# EAGLE design mml_mcu (EAGLE 9.6.2)

## Sheet 1 of 2
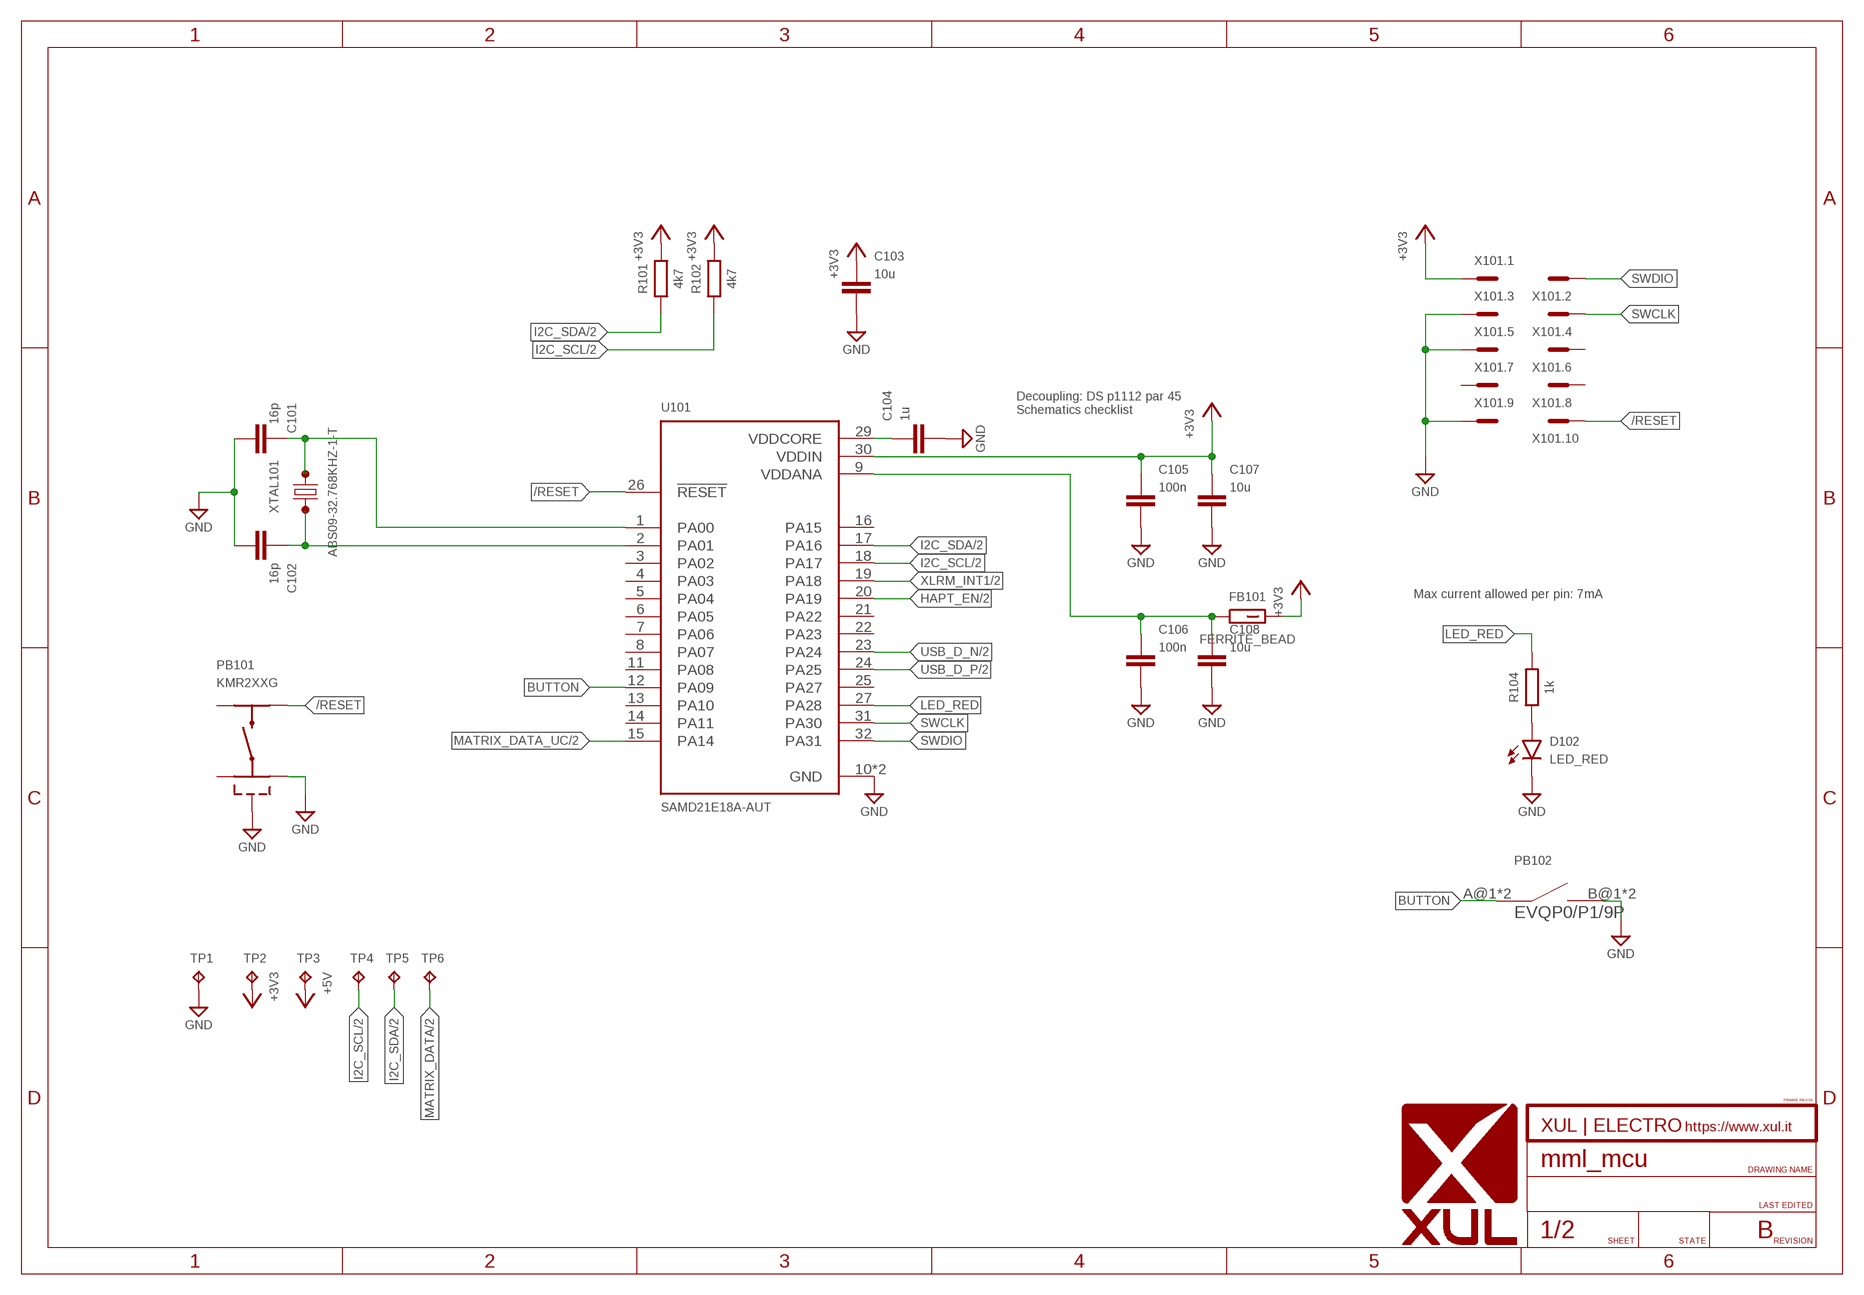
[diagram p0: schematic, sheet 1]
FRAME101 (FRAME-XUL-A4L-LOC): REV: B

### Parts
C101  16p  C_CHIP-0603(1608-METRIC)  [CAPC1608X85]
C102  16p  C_CHIP-0603(1608-METRIC)  [CAPC1608X85]
C103  10u  C_CHIP-0805(2012-METRIC)  [CAPC2012X110]
C104  1u  C_CHIP-0603(1608-METRIC)  [CAPC1608X85]
C105  100n  C_CHIP-0603(1608-METRIC)  [CAPC1608X85]
C106  100n  C_CHIP-0603(1608-METRIC)  [CAPC1608X85]
C107  10u  C_CHIP-0805(2012-METRIC)  [CAPC2012X110]
C108  10u  C_CHIP-0805(2012-METRIC)  [CAPC2012X110]
D102  LED_RED  CHIP-FLAT-R_0805  [LEDC2012X110N_FLAT-R]
FB101  FERRITE_BEAD  FBCHIP-0603(1608-METRIC)  [BEADC1608X95N]
PB101  KMR2XXG  [KMR2XXG]
PB102  EVQP0/P1/9P  [EVQP0/P1/9P]
R101  4k7  R_CHIP-0603(1608-METRIC)  [RESC1608X60]
R102  4k7  R_CHIP-0603(1608-METRIC)  [RESC1608X60]
R104  1k  R_CHIP-0603(1608-METRIC)  [RESC1608X60]
TP1  TPTP15R  [TP15R]
TP2  TPTP15R  [TP15R]
TP3  TPTP15R  [TP15R]
TP4  TPTP15R  [TP15R]
TP5  TPTP15R  [TP15R]
TP6  TPTP15R  [TP15R]
U101  SAMD21E18A-AUT  SAMD21E  [QFP80P900X900X120-32N]
X101  M50-3600542R  [M50-3600542R]
XTAL101  ABS09-32.768KHZ-1-T  CM415  [XTAL410X150X90]

### Nets
+3V3: C103.1 C105.1 C107.1 FB101.2 R101.2 R102.2 TP2.TP U101.30(VDDIN) X101.1 ; also sheet 2
+5V: TP3.TP ; also sheet 2
/RESET: PB101.1 U101.26(!RESET) X101.10
BUTTON: PB102.A@1(A) PB102.A@2(A) U101.12(PA09)
GND: C101.2 C102.2 C103.2 C104.2 C105.2 C106.2 C107.2 C108.2 D102.C PB101.2 PB101.5 PB102.B@1(B) PB102.B@2(B) TP1.TP U101.10(GND) U101.28(GND) X101.3 X101.5 X101.9 ; also sheet 2
HAPT_EN: U101.20(PA19) ; also sheet 2
I2C_SCL: R102.1 TP4.TP U101.18(PA17) ; also sheet 2
I2C_SDA: R101.1 TP5.TP U101.17(PA16) ; also sheet 2
LED_RED: R104.2 U101.27(PA28)
MATRIX_DATA: TP6.TP ; also sheet 2
MATRIX_DATA_UC: U101.15(PA14) ; also sheet 2
N$13: C101.1 U101.1(PA00) XTAL101.1(A)
N$14: C102.1 U101.2(PA01) XTAL101.2(B)
N$15: C104.1 U101.29(VDDCORE)
N$17: D102.A R104.1
N$23: C106.1 C108.1 FB101.1 U101.9(VDDANA)
SWCLK: U101.31(PA30) X101.4
SWDIO: U101.32(PA31) X101.2
USB_D_N: U101.23(PA24) ; also sheet 2
USB_D_P: U101.24(PA25) ; also sheet 2
XLRM_INT1: U101.19(PA18) ; also sheet 2
Unconnected: PB101.3 PB101.4 U101.3(PA02) U101.4(PA03) U101.5(PA04) U101.6(PA05) U101.7(PA06) U101.8(PA07) U101.11(PA08) U101.13(PA10) U101.14(PA11) U101.16(PA15) U101.21(PA22) U101.22(PA23) U101.25(PA27) X101.6 X101.7 X101.8

### Notes on the sheet
- Decoupling: DS p1112 par 45
  Schematics checklist
- Max current allowed per pin: 7mA

## Sheet 2 of 2
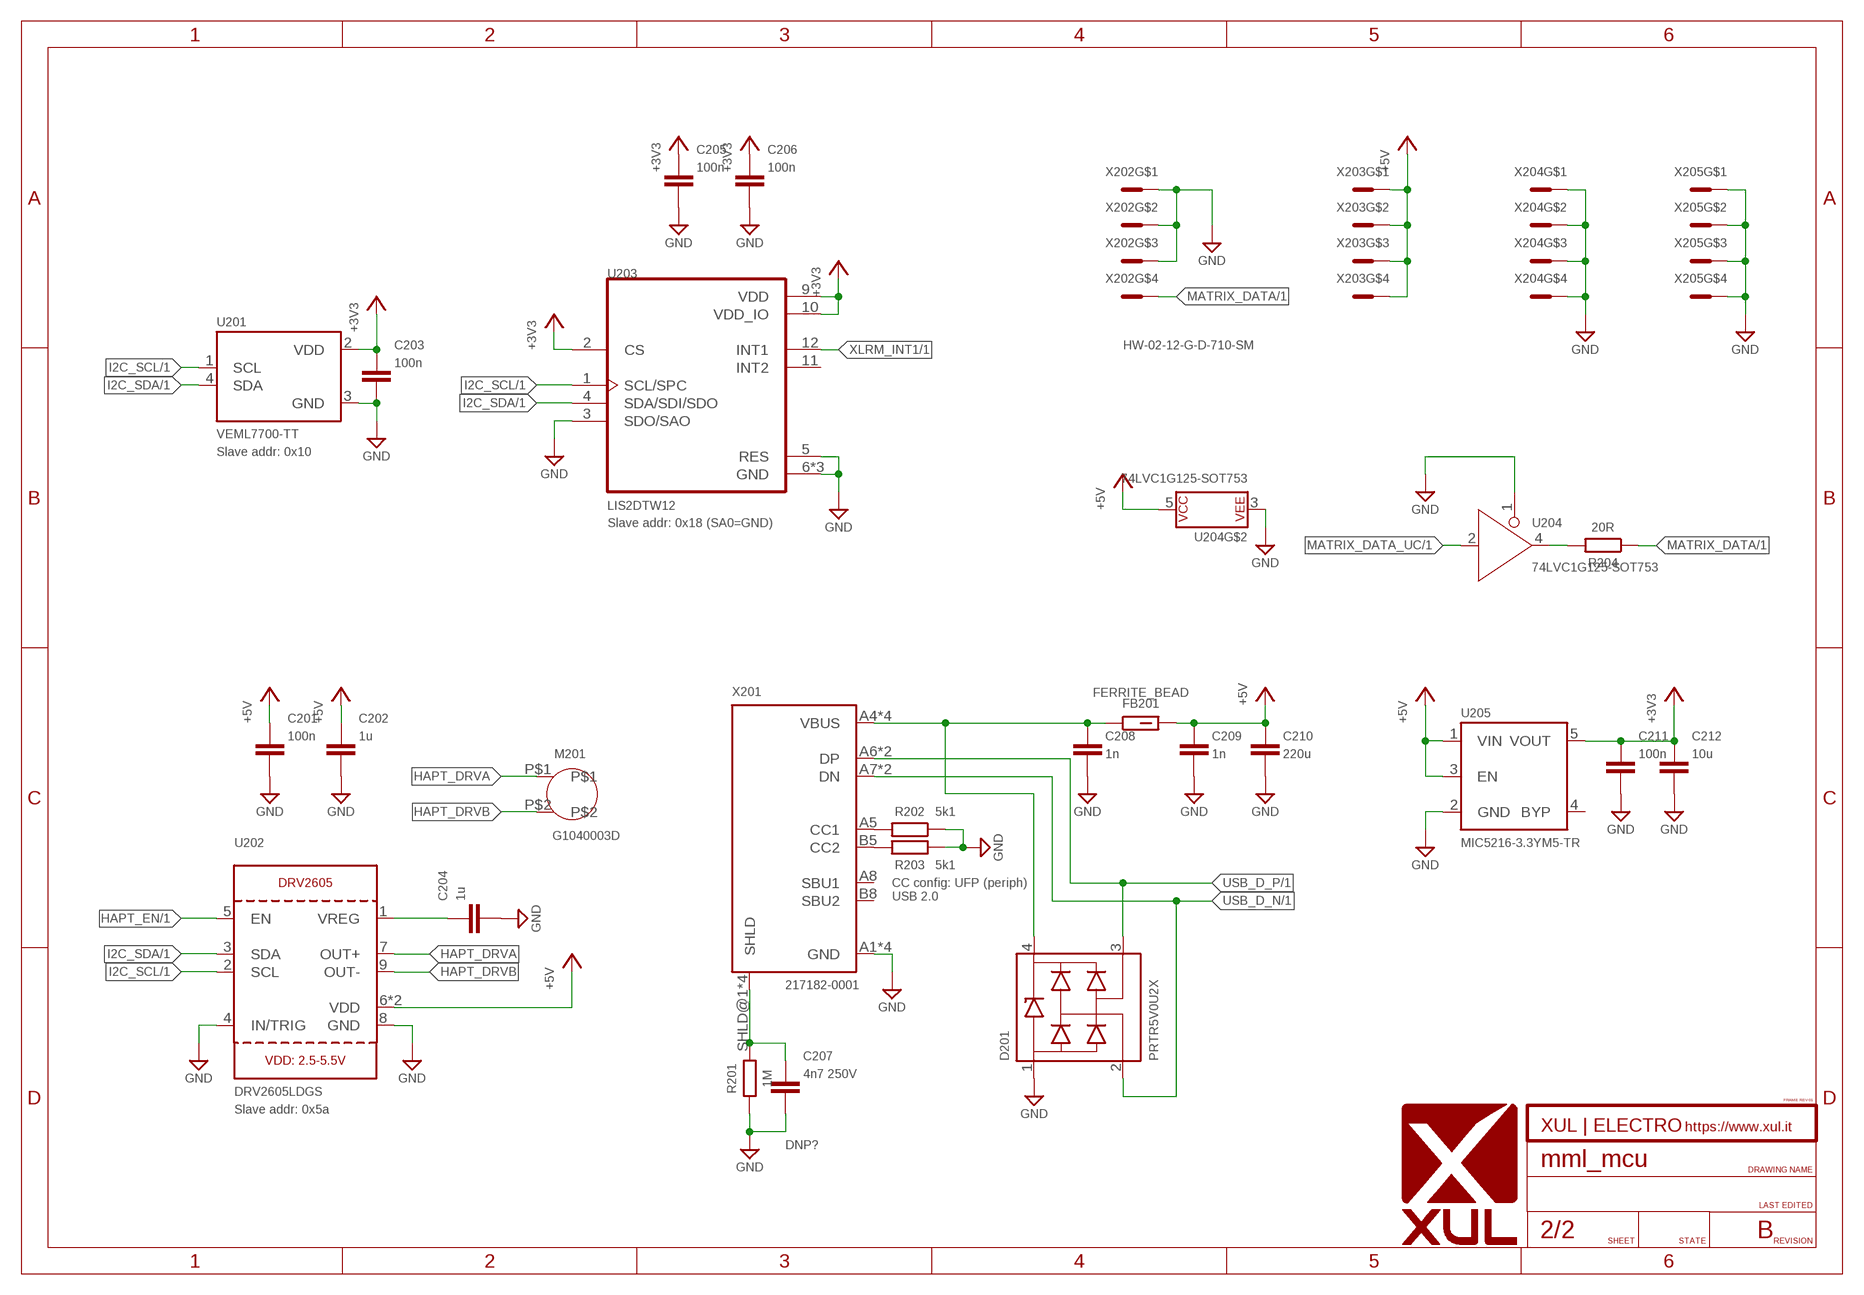
[diagram p1: schematic, sheet 2]
FRAME201 (FRAME-XUL-A4L-LOC): REV: B

### Parts
C201  100n  C_CHIP-0603(1608-METRIC)  [CAPC1608X85]
C202  1u  C_CHIP-0603(1608-METRIC)  [CAPC1608X85]
C203  100n  C_CHIP-0603(1608-METRIC)  [CAPC1608X85]
C204  1u  C_CHIP-0603(1608-METRIC)  [CAPC1608X85]
C205  100n  C_CHIP-0603(1608-METRIC)  [CAPC1608X85]
C206  100n  C_CHIP-0603(1608-METRIC)  [CAPC1608X85]
C207  4n7 250V  C_CHIP-0603(1608-METRIC)  [CAPC1608X85]
C208  1n  C_CHIP-0603(1608-METRIC)  [CAPC1608X85]
C209  1n  C_CHIP-0603(1608-METRIC)  [CAPC1608X85]
C210  220u  C_CHIP-1206(3216-METRIC)  [CAPC3216X135]
C211  100n  C_CHIP-0603(1608-METRIC)  [CAPC1608X85]
C212  10u  C_CHIP-0805(2012-METRIC)  [CAPC2012X110]
D201  PRTR5V0U2X  [SOT190P230X110-4N]
FB201  FERRITE_BEAD  FBCHIP-0603(1608-METRIC)  [BEADC1608X95N]
M201  G1040003D  [G1040003D]
R201  1M  R_CHIP-0603(1608-METRIC)  [RESC1608X60]
R202  5k1  R_CHIP-0603(1608-METRIC)  [RESC1608X60]
R203  5k1  R_CHIP-0603(1608-METRIC)  [RESC1608X60]
R204  20R  R_CHIP-0603(1608-METRIC)  [RESC1608X60]
U201  VEML7700-TT  [XDCR_VEML7700-TT]
U202  DRV2605LDGS  DRV2605_SOP  [PSOP10]
U203  LIS2DTW12  LIS2DH12TR  [PQFN50P200X200100-12N]
U204  74LVC1G125-SOT753  [SOT95P280X145-5N]
U205  MIC5216-3.3YM5-TR  SPX3819SOT-23-5  [SOT95P280X145-5N]
X201  217182-0001  [217182-0001]
X202  HW-02-10-T-D-500-SM  [HW-02-10-T-D-500-SM]
X203  HW-02-10-T-D-500-SM  [HW-02-10-T-D-500-SM]
X204  HW-02-10-T-D-500-SM  [HW-02-10-T-D-500-SM]
X205  HW-02-10-T-D-500-SM  [HW-02-10-T-D-500-SM]

### Nets
+3V3: C203.1 C205.1 C206.1 C211.1 C212.1 U201.2(VDD) U203.2(CS) U203.9(VDD) U203.10(VDD_IO) U205.5(VOUT) ; also sheet 1
+5V: C201.1 C202.1 C209.1 C210.1 FB201.2 U202.6(VDD) U202.10(VDD) U204.5(P$V+) U205.1(VIN) U205.3(EN) X203.P$1 X203.P$2 X203.P$3 X203.P$4 ; also sheet 1
GND: C201.2 C202.2 C203.2 C204.2 C205.2 C206.2 C207.2 C208.2 C209.2 C210.2 C211.2 C212.2 D201.1 R201.1 R202.1 R203.1 U201.3(GND) U202.4(IN/TRIG) U202.8(GND) U203.3(SDO/SAO) U203.5(RES) U203.6(GND) U203.7(GND) U203.8(GND) U204.1(/OE) U204.3(P$V-) U205.2(GND) X201.A1(GND) X201.A12(GND) X201.B1(GND) X201.B12(GND) X202.P$1 X202.P$2 X202.P$3 X204.P$1 X204.P$2 X204.P$3 X204.P$4 X205.P$1 X205.P$2 X205.P$3 X205.P$4 ; also sheet 1
HAPT_DRVA: M201.P$1 U202.7(OUT+)
HAPT_DRVB: M201.P$2 U202.9(OUT-)
HAPT_EN: U202.5(EN) ; also sheet 1
I2C_SCL: U201.1(SCL) U202.2(SCL) U203.1(SCL/SPC) ; also sheet 1
I2C_SDA: U201.4(SDA) U202.3(SDA) U203.4(SDA/SDI/SDO) ; also sheet 1
MATRIX_DATA: R204.1 X202.P$4 ; also sheet 1
MATRIX_DATA_UC: U204.2(A) ; also sheet 1
N$1: C204.1 U202.1(VREG)
N$2: C207.1 R201.2 X201.SHLD@1(SHLD) X201.SHLD@2(SHLD) X201.SHLD@3(SHLD) X201.SHLD@4(SHLD)
N$10: C208.1 D201.4 FB201.1 X201.A4(VBUS) X201.A9(VBUS) X201.B4(VBUS) X201.B9(VBUS)
N$16: R204.2 U204.4(Y)
N$20: R202.2 X201.A5(CC1)
N$21: R203.2 X201.B5(CC2)
USB_D_N: D201.2 X201.A7(DN) X201.B7(DN) ; also sheet 1
USB_D_P: D201.3 X201.A6(DP) X201.B6(DP) ; also sheet 1
XLRM_INT1: U203.12(INT1) ; also sheet 1
Unconnected: U203.11(INT2) U205.4(BYP) X201.A8(SBU1) X201.B8(SBU2)

### Notes on the sheet
- HW-02-12-G-D-710-SM
- Slave addr: 0x10
- Slave addr: 0x18 (SA0=GND)
- CC config: UFP (periph)
  USB 2.0
- Slave addr: 0x5a
- DNP?

## Library data of the parts
C101-C108 C201-C212 = Capacitor:C: Capacitor - Generic; CATEGORY: Capacitor
D102 = LED:CHIP-FLAT-R; CATEGORY: LED; COLOR: RED; DESCRIPTION: CHIP LED FLAT; SUB-CATEGORY: CHIP; TYPE: FLAT_TOP
D201 = xul:PRTR5V0U2X: PRTR5V0U2X Ultra low capacitance double rail-to-rail ESD protection diode
FB101 FB201 = Filter:FB: Ferrite Bead - Generic; CATEGORY: Filter; SUB-CATEGORY: Ferrite bead
M201 = xul:G1040003D: Jinlong Machinery & Electronics G1040003D LRA Coin Vibration Motor
PB101 = xul:KMR2XXG: KMR2 series Tactile SPST-NO switch
PB102 = xul:EVQP0/P1/9P
R101 R102 R104 R201-R204 = Resistor:R: Resistor Fixed - Generic; CATEGORY: Resistor; SUB-CATEGORY: Fixed
TP1-TP6 = testpad:TP: Test pad
U101 = xul:SAMD21E: ARM Cortex-M0+ SAM D21E Microcontroller IC 32-Bit 48MHz 256KB (256K x 8) FLASH 32-TQFP (7x7) Check prices <https://pricing.snapeda.com/parts/ATSAMD21E18A-AUT/Microchip/view-part?ref=eda>
U201 = xul:VEML7700-TT: Ambient Light Sensors Opr 2.5-3.6V 0.005lx Top View 16bit I2C Check prices <https://pricing.snapeda.com/parts/VEML7700-TT/Vishay%20Semiconductor/view-part?ref=eda>; AVAILABILITY: In Stock; DESCRIPTION: Optical Sensor 4-SMD, J-Lead; MF: Vishay Semiconductor; MP: VEML7700-TT; PACKAGE: SMD-4 Vishay Semiconductor; PRICE: None; PURCHASE-URL: https://pricing.snapeda.com/search/part/VEML7700-TT/?ref=eda
U202 = microbuilder:DRV2605: DRV2605 - Haptic Driver for ERM/LRA Motors; LCSC_PART: C527464
U203 = LIS2DH12TR:LIS2DH12TR: MEMS digital output motion sensor: ultra low-power high performance 3-axes femto accelerometer Check prices <https://pricing.snapeda.com/parts/LIS2DH12TR/STMicroelectronics/view-part?ref=eda>; AVAILABILITY: In Stock; DESCRIPTION: Accelerometer X, Y, Z Axis ±2g, 4g, 8g, 16g 0.5Hz ~ 672Hz 12-LGA (2x2); LCSC_PART: C110926; MF: STMicroelectronics; MP: LIS2DH12TR; PACKAGE: LGA-12 STMicroelectronics; PRICE: None; PURCHASE-URL: https://pricing.snapeda.com/search/part/LIS2DH12TR/?ref=eda
U204 = xul:74LVC1G125
U205 = xul-vreg:SPX3819: SPX3819 500mA Low-Noise LDO Voltage Regulator
X101 = xul:M50-3600542R: Harwin M50-3600542R 2x5 SMT 50mils pinheader
X201 = xul:217182-0001: MOLEX 217182-0001 USB-Socket Vertical SMT L6.4 16C Type C Rec. USB2.0
X202-X205 = xul:HW-02-10-T-D-500-SM: HW-02-10-T-D-500-SM 2x2 SMD High Temperature Flexible Board Stacking Header, 0.100" Pitch
XTAL101 = xul:CM415: Citizen TUNING FORK 32768Hz CRYSTAL UNIT SMD

## Board
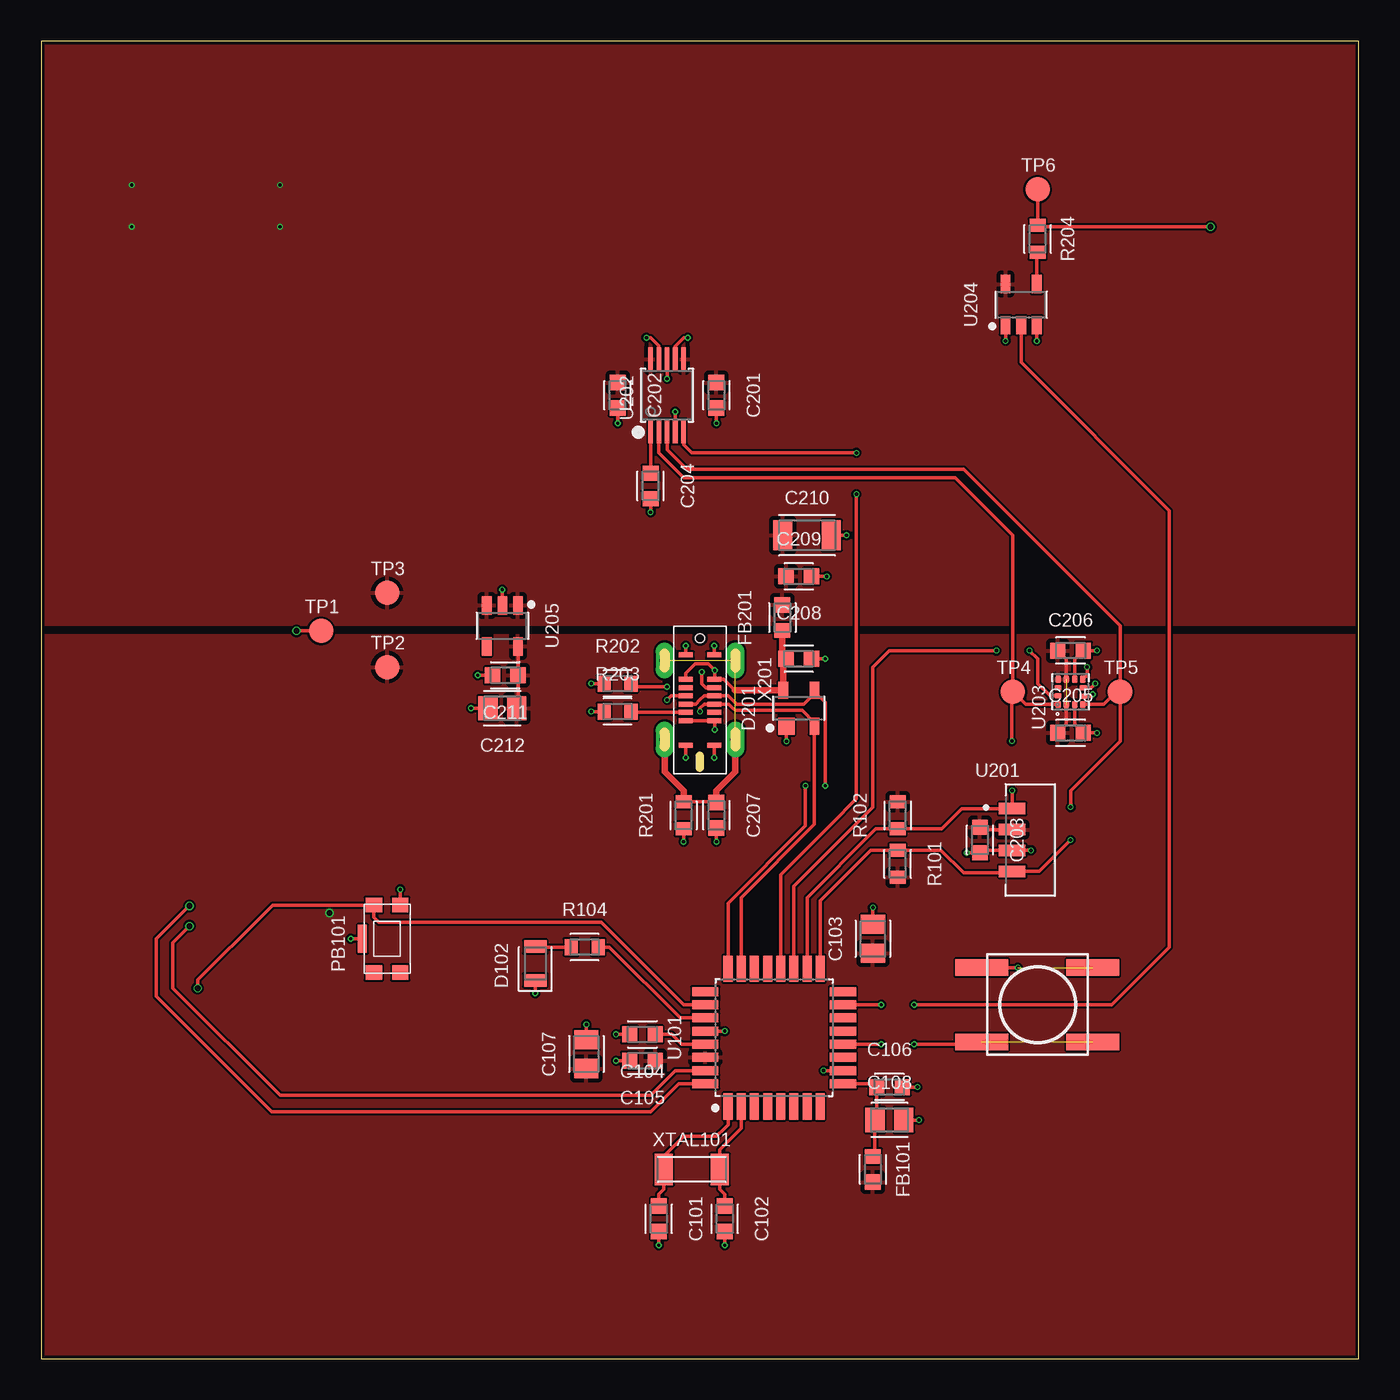
[diagram p2: board, top side]
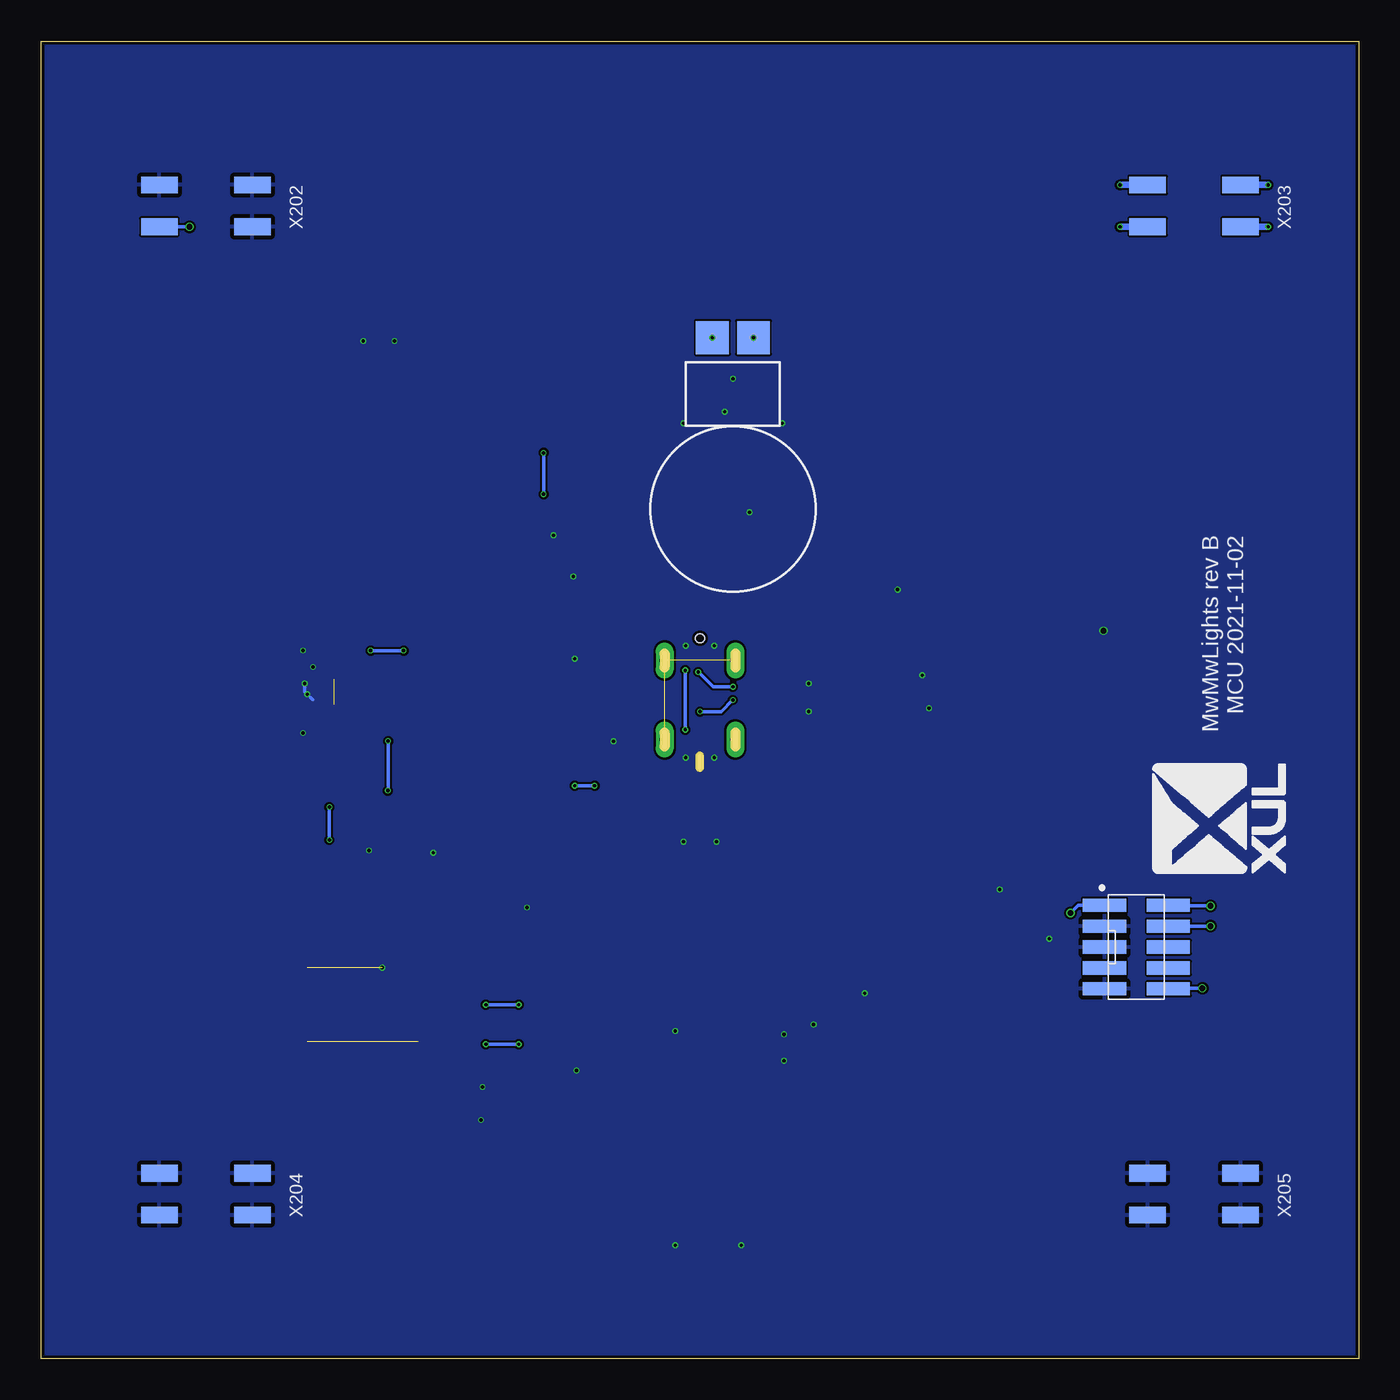
[diagram p3: board, bottom side, seen from below]

Size 80 x 80 mm. Coordinates in mm from the lower left corner, seen from the top.
Outline: 0,0 80,0 80,80 0,80 0,0
Copper layers (1*16): Top 0.035mm / dielectric 1.6mm / Bottom 0.035mm
Design rules "jlcpcb-2layers *": minimum track width 5mil, minimum drill 0.2mm, track to track 5mil, track to pad 5mil, pad to pad 5mil, via to via 5mil, smd to smd 5mil, copper to edge 0.2mm, drill to drill 6mil, minimum pad ring 10mil, minimum via ring 3mil, stop-mask expansion 4mil, vias tented up to drill 0mil, thermal gap 10mil

### Footprints (pad centres in the part's own frame; a part is rotated, then mirrored left to right if it is on the bottom)
CAPC1608X85 = smd 0.921 x 0.97: 1 -0.775,0; 2 0.775,0
CAPC2012X110 = smd 1.165 x 1.465: 1 -0.875,0; 2 0.875,0
CAPC3216X135 = smd 1.165 x 1.815: 1 -1.475,0; 2 1.475,0
LEDC2012X110N_FLAT-R = smd 0.762 x 1.362: A 1.025,0; C -1.025,0
SOT190P230X110-4N = smd 1.022 x 0.99: 1 -1.097,0.75 | smd 1.022 x 0.59: 2 -1.097,-0.95; 3 1.097,-0.95; 4 1.097,0.95
BEADC1608X95N = smd 0.9 x 0.97: 1 -0.785,0 | smd 0.933 x 0.97: 2 0.769,0
G1040003D = smd 2 x 2: P$1 3,1.25; P$2 3,-1.25
KMR2XXG = smd 0.9 x 1: 1 2.05,0.8; 2 2.05,-0.8; 3 -2.05,-0.8; 4 -2.05,0.8 | smd 1.7 x 0.55: 5 0,1.5
EVQP0/P1/9P = smd 1 x 3.2: A@1 -2.25,-3.34; A@2 -2.25,3.4; B@1 2.25,-3.34; B@2 2.25,3.4
RESC1608X60 = smd 0.799 x 0.974: 1 -0.815,0; 2 0.815,0
TP15R = smd 1.5 x 1.5: TP 0,0
QFP80P900X900X120-32N = smd 1.6 x 0.547: 1 -4.181,2.8; 2 -4.181,2; 3 -4.181,1.2; 4 -4.181,0.4; 5 -4.181,-0.4; 6 -4.181,-1.2; 7 -4.181,-2; 8 -4.181,-2.8; 17 4.181,-2.8; 18 4.181,-2; 19 4.181,-1.2; 20 4.181,-0.4; 21 4.181,0.4; 22 4.181,1.2; 23 4.181,2; 24 4.181,2.8 | smd 0.547 x 1.6: 9 -2.8,-4.181; 10 -2,-4.181; 11 -1.2,-4.181; 12 -0.4,-4.181; 13 0.4,-4.181; 14 1.2,-4.181; 15 2,-4.181; 16 2.8,-4.181; 25 2.8,4.181; 26 2,4.181; 27 1.2,4.181; 28 0.4,4.181; 29 -0.4,4.181; 30 -1.2,4.181; 31 -2,4.181; 32 -2.8,4.181
XDCR_VEML7700-TT = smd 1.6 x 0.7: 1 -1.55,1.905; 2 -1.55,0.635; 3 -1.55,-0.635; 4 -1.55,-1.905
PSOP10 = smd 0.28 x 1.45: 1 -1,-2.2; 2 -0.5,-2.2; 3 0,-2.2; 4 0.5,-2.2; 5 1,-2.2; 6 1,2.2; 7 0.5,2.2; 8 0,2.2; 9 -0.5,2.2; 10 -1,2.2
PQFN50P200X200100-12N = smd 0.45 x 0.35: 1 -0.765,0.75; 2 -0.765,0.25; 3 -0.765,-0.25; 4 -0.765,-0.75; 7 0.765,-0.75; 8 0.765,-0.25; 9 0.765,0.25; 10 0.765,0.75 | smd 0.35 x 0.45: 5 -0.265,-0.765; 6 0.25,-0.765; 11 0.25,0.765; 12 -0.25,0.765
SOT95P280X145-5N = smd 1.119 x 0.59: 1 -1.246,0.95; 2 -1.246,0; 3 -1.246,-0.95; 4 1.246,-0.95; 5 1.246,0.95
SOT95P280X145-5N' = smd 1.119 x 0.589: 1 -1.246,0.95; 2 -1.246,0; 3 -1.246,-0.95; 4 1.246,-0.95; 5 1.246,0.95
M50-3600542R = smd 0.8 x 2.62: 1 -2.54,-1.94; 2 -2.54,1.94; 3 -1.27,-1.94; 4 -1.27,1.94; 5 0,-1.94; 6 0,1.94; 7 1.27,-1.94; 8 1.27,1.94; 9 2.54,-1.94; 10 2.54,1.94
217182-0001 = smd 0.3 x 0.87: A1 -2.75,0.865; A4 -1.25,0.865; A5 -0.75,0.865; A6 -0.25,0.865; A7 0.25,0.865; A8 0.75,0.865; A9 1.25,0.865; A12 2.75,0.865; B1 2.75,-0.865; B4 1.25,-0.865; B5 0.75,-0.865; B6 0.25,-0.865; B7 -0.25,-0.865; B8 -0.75,-0.865; B9 -1.25,-0.865; B12 -2.75,-0.865 | drill 0.6 long: SHLD@1 -2.4,2.15; SHLD@2 2.4,2.15; SHLD@3 -2.4,-2.15; SHLD@4 2.4,-2.15 | hole 0.52: -3.75,0
HW-02-10-T-D-500-SM = smd 1.016 x 2.223: P$1 -1.27,2.826; P$2 1.27,2.826; P$3 -1.27,-2.826; P$4 1.27,-2.826
XTAL410X150X90 = smd 1.1 x 1.9: 1 -1.7,0; 2 1.7,0

### Placement (x,y rotation side)
C101  37.5,8.5 270 top
C102  41.5,8.5 270 top
C103  50.5,25.5 90 top
C104  36.5,19.7 180 top
C105  36.5,18.1 180 top
C106  51.5,16.5 0 top
C107  33.1,18.5 90 top
C108  51.5,14.5 0 top
C201  41,58.5 270 top
C202  35,58.5 270 top
C203  57,31.5 270 top
C204  37,53 270 top
C205  62.5,38 0 top
C206  62.5,43 0 top
C207  41,33 270 top
C208  46,42.5 0 top
C209  46,47.5 0 top
C210  46.5,50 0 top
C211  28.18,41.5 180 top
C212  28,39.5 180 top
D102  30,24 90 top
D201  46,39.5 90 top
FB101  50.5,11.5 270 top
FB201  45,45 90 top
M201  38,59 90 bottom
PB101  21,25.5 90 top
PB102  60.5,21.5 90 top
R101  52,30.06 270 top
R102  52,33 90 top
R104  33,25 0 top
R201  39,33 90 top
R202  35,41 0 top
R203  35,39.3 0 top
R204  60.5,68 270 top
TP1  17,44.2 0 top
TP2  21,42 0 top
TP3  21,46.5 0 top
TP4  59,40.5 0 top
TP5  65.5,40.5 0 top
TP6  60.5,71 0 top
U101  44.5,19.5 90 top
U201  60.5,31.5 0 top
U202  38,58.5 0 top
U203  62.5,40.5 90 top
U204  59.5,64 90 top
U205  MIC5216-3.3YM5-TR  [SOT95P280X145-5N']  28,44.5 270 top
U$1  [XUL-LOGO-8MMH]  12.5,29.5 90 bottom
X101  13.5,25 270 bottom
X201  40,40 270 top
X202  70,70 270 bottom
X203  10,70 270 bottom
X204  70,10 270 bottom
X205  10,10 270 bottom
XTAL101  39.5,11.5 0 top

### Tracks (layer width: path | path; a pad name or v marks a point on that pad's centre or on a via)
+3V3  (via drill 0.35)  (1 unrouted)
  Top 0.2: U203.2 62.25,38.52 C205.1 | U203.9 62.25,42.48 C206.1 | U205.5 C211.1 28.95,39.58 C212.1 | U201.2 57.14,32.13 C203.1
  Bottom 0.2: X101.1 17.03,27.54 v17.5,27.07
  pour Top: 0.1,0.1 79.9,0.1 79.9,43.9 0.1,43.9
+5V  (via drill 0.2)
  Bottom 0.4: X203.P$3 v14.5,71.27 | X203.P$4 v14.5,68.73 | X203.P$1 v5.5,71.27 | X203.P$2 v5.5,68.73
  pour Top: 0.1,44.6 79.9,44.6 79.9,79.9 0.1,79.9
/RESET  (via drill 0.35)
  Top 0.2: U101.26 39,21.5 36.25,24.25 34,26.5 20.5,26.5 20.2,26.8 PB101.1 14.05,27.55 13.5,27 9.5,23 v9.5,22.5
  Bottom 0.2: v9.5,22.5 11.52,22.5 X101.10
BUTTON  (via drill 0.2)  (1 unrouted)
  Top 0.2: U101.12 v51,19.1 | v53,19.1 54.5,19.1 56.95,19.1 PB102.A@2
  Bottom 0.2: v51,19.1 v53,19.1
GND  (via drill 0.2, 0.35)  (1 unrouted)
  Top 0.2: U202.8 v38,59.5 | U203.3 62.75,38.52 C205.2 v64.1,38 | U203.8 62.75,42.48 C206.2 v64.1,43 | D201.1 v45.25,37.5 | U202.4 v38.5,57.5 | X201.B1 v39.13,36.5 | X201.A12 v40.87,36.5 | X201.B12 v39.13,43.3 | X201.A1 v40.87,43.3 | C202.2 v35,56.8 | C201.2 v41,56.8 | U204.1 v58.55,61.8 | U204.3 v60.45,61.8 | U205.2 v28,46.7 | C212.2 v26.1,39.5 | C211.2 v26.5,41.5 | v60.1,30.86 U201.3 57.14,30.86 C203.2 v56.2,30.73 | C103.2 v50.5,27.4 | U101.10 v47.5,17.5 | U101.28 v41.5,19.9 | C106.2 v53.2,16.5 | C108.2 v53.3,14.5 | C101.2 v37.5,6.9 | C102.2 v41.5,6.9 | C107.2 v33.1,20.3 | C104.2 v34.9,19.7 | C105.2 v34.9,18.1 | D102.C v30,22.2 | R201.1 v39,31.4 | C207.2 v41,31.4 | R203.1 v33.4,39.3 | R202.1 v33.4,41 | C208.2 v47.6,42.5 | C209.2 v47.7,47.5 | C210.2 v48.9,50 | C204.2 v37,51.4 | U203.7 63.5,41.52 v63.5,42 | U203.6 63.75,40.75 v64,41 | U203.5 63.73,40.23 v63.85,40.35 | PB102.B@2 v59.3,23.75 | TP1.TP v15.5,44.2 | PB101.5 v18.8,25.5 | PB101.2 v21.8,28.5
  Bottom 0.2: v64,41 64,40.5 v63.85,40.35 63.5,40
  pour Bottom: 0.1,0.1 79.9,0.1 79.9,79.9 0.1,79.9
HAPT_DRVA  (via drill 0.2)
  Top 0.2: M201.P$1 39.01,62 38.5,61.49 U202.7
  other vias: 39.25,62
HAPT_DRVB  (via drill 0.2)
  Top 0.2: U202.9 37.5,61.5 37,62 M201.P$2
  other vias: 36.75,62
HAPT_EN  (via drill 0.2)
  Top 0.2: U101.20 44.9,29.4 48,32.5 49.5,34 v49.5,52.5 | v49.5,55 39.5,55 39,55.5 U202.5
  Bottom 0.2: v49.5,52.5 v49.5,55
I2C_SCL  (via drill 0.2)
  Top 0.2: U101.18 46.5,28 50.5,32 50.69,32.19 R102.1 54.69,32.19 55.5,33 55.91,33.41 U201.1 v58.95,34.5 | U203.1 59.77,39.73 TP4.TP | U202.2 37.5,55 39,53.5 55.5,53.5 59,50 59,43.5 59,42 TP4.TP | v58.94,37.51 58.94,40.44 TP4.TP
  Bottom 0.2: v58.94,37.51 v58.94,34.51 v58.95,34.5
I2C_SDA  (via drill 0.2)
  Top 0.2: U101.17 47.3,27.8 50,30.5 50.37,30.87 R101.1 54.63,30.87 56,29.5 58.85,29.5 U201.4 60.59,29.59 v62.5,31.5 | v62.5,33.5 62.5,34.5 64.5,36.5 65.5,37.5 TP5.TP | U203.4 64.5,39.73 65.27,40.5 TP5.TP | U202.3 38,55.2 39.2,54 56,54 65.5,44.5 TP5.TP
  Bottom 0.2: v62.5,31.5 v62.5,33.5
LED_RED
  Top 0.2: U101.27 38.8,20.7 34.5,25 R104.2
MATRIX_DATA  (via drill 0.35)
  Top 0.2: R204.1 60.59,68.73 | v71,68.73 60.59,68.73 | 60.59,68.73 R204.1 | R204.1 TP6.TP
  Bottom 0.2: v71,68.73 X202.P$4
MATRIX_DATA_UC  (via drill 0.2)
  Top 0.2: U204.2 59.5,60.5 68.5,51.5 68.5,24.99 65.01,21.5 v53,21.5 | U101.15 v51,21.5
  Bottom 0.2: v51,21.5 v53,21.5
N$1
  Top 0.2: C204.1 U202.1
N$2  (2 unrouted)
  Top 0.2: R201.2 40.96,33.81 C207.1
  Top 0.4: X201.SHLD@4 37.85,35.65 38.5,35 39,34.5 R201.2 | X201.SHLD@2 42.15,35.65 41,34.5 C207.1
N$10  (via drill 0.2)
  Top 0.2: 42.09,40.6 41.44,41.25 X201.A4 40.9,41.28 v40.9,41.8 40.5,42.2 40,42.2 39.7,42.2 39.5,42 39.13,41.63 X201.B9 | v40.9,38.2 40.9,38.72 X201.A9 X201.B4
  Top 0.4: 42.09,40.6 D201.4 45.05,42.33 C208.1 45,42.73 FB201.1
  Bottom 0.2: v40.9,41.8 v40.9,38.2
N$13
  Top 0.2: U101.1 41.7,14.2 41.5,14 41,13.5 39,13.5 37.8,12.3 XTAL101.1 37.8,10.3 37.5,10 C101.1
N$14
  Top 0.2: U101.2 42.5,14 41.5,13 41.2,12.7 XTAL101.2 41.2,10.3 41.5,10 C102.1
N$15
  Top 0.2: U101.29 38.9,19.1 38.5,19.5 38.3,19.7 C104.1
N$16
  Top 0.2: U204.4 60.45,67.14 R204.2
N$17
  Top 0.2: R104.1 30.02,25 D102.A
N$20  (via drill 0.2)
  Top 0.2: X201.A5 40.35,40.75 40.1,41 v40.1,41.7 | v38,40.8 36.02,40.8 R202.2
  Bottom 0.2: v40.1,41.7 39.2,40.8 v38,40.8
N$21
  Top 0.2: X201.B5 35.87,39.25 R203.2
N$23
  Top 0.2: U101.9 50.52,16.7 C106.1 50.73,14.6 C108.1 50.62,12.41 FB101.1
SWCLK  (via drill 0.35)
  Top 0.2: U101.31 38.5,17.5 37,16 29,16 14.5,16 8,22.5 8,25.27 v9,26.27
  Bottom 0.2: X101.4 v9,26.27
SWDIO  (via drill 0.35)
  Top 0.2: U101.32 38.7,16.7 38.5,16.5 37,15 28.5,15 14,15 7,22 7,22.5 7,25.5 v9,27.5
  Bottom 0.2: X101.2 11.52,27.5 v9,27.5
USB_D_N  (via drill 0.2)
  Top 0.2: v40,39.3 40,39.5 40.25,39.75 X201.A7 41.7,39.75 41.75,39.75 42,39.5 42.13,39.37 46,39.37 46.2,39.37 46.95,38.62 D201.2 46.95,32.45 42.5,28 42.5,24.88 U101.23 | X201.B7 38.25,40.25 v38,40
  Bottom 0.2: v40,39.3 39.5,39.3 38.7,39.3 v38,40
USB_D_P  (via drill 0.2)
  Top 0.2: X201.B6 39.75,39.75 40,40 40.25,40.25 X201.A6 41.7,40.25 41.71,40.25 42.23,39.73 46.3,39.73 46.95,40.38 46.95,40.5 | 46.95,40.5 D201.3 | U101.24 41.7,24.88 41.7,27.66 46.4,32.36 v46.4,34.8 | v47.6,34.8 47.6,39.85 46.95,40.5
  Bottom 0.2: v46.4,34.8 v47.6,34.8
XLRM_INT1  (via drill 0.2)
  Top 0.2: U101.19 45.7,28.7 50,33 50.5,33.5 50.5,36 50.5,42 51.5,43 v58,43 | v60,43 60.5,42.5 60.5,41 61.25,40.25 U203.12
  Bottom 0.2: v58,43 v60,43

### Text on the board
bPlace: MwMwLights rev B / MCU 2021-11-02
200bmp: C:/Users/xi/Downloads/mml-qr.bmp